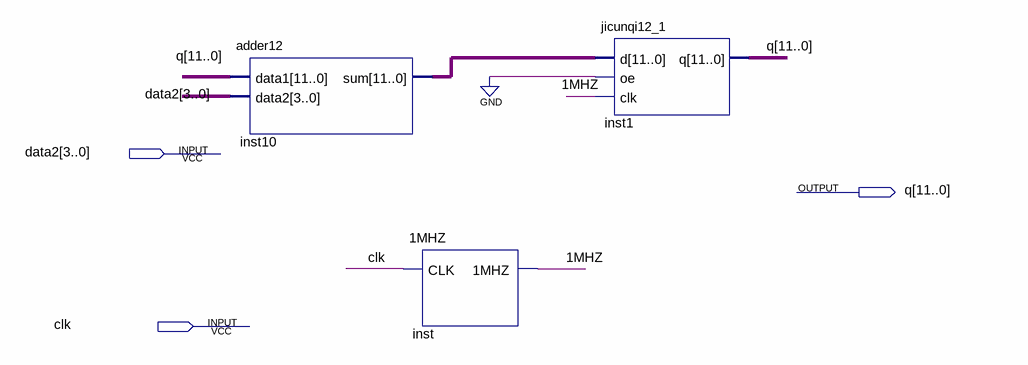
[diagram p0: schematic sheet]
// Quartus schematic suocun.bdf as structural Verilog: 3 symbols, 3 pins
module suocun (
  input  [3:0] data2,
  input  clk,
  output [11:0] q
);

  wire \1MHZ ;
  wire [11:0] inst10_sum;

  adder12 inst10 (.data1(q), .data2(data2), .sum(inst10_sum));
  \1MHZ  inst (.CLK(clk), .\1MHZ (\1MHZ ));
  jicunqi12_1 inst1 (.d(inst10_sum), .oe(1'b0), .clk(\1MHZ ), .q(q));
endmodule
